# EasyEDA Pro project ProDocument_AD9744_2025-01-04.epro

# Schematic Schematic4
Create Date: 2023-10-30; Page Name: P1; Project Name: STI_Project; Schematic Name: Schematic4; Update Date: 2023-11-23; Company: 嘉立创EDA; Page Size: A4; Version: V1.0
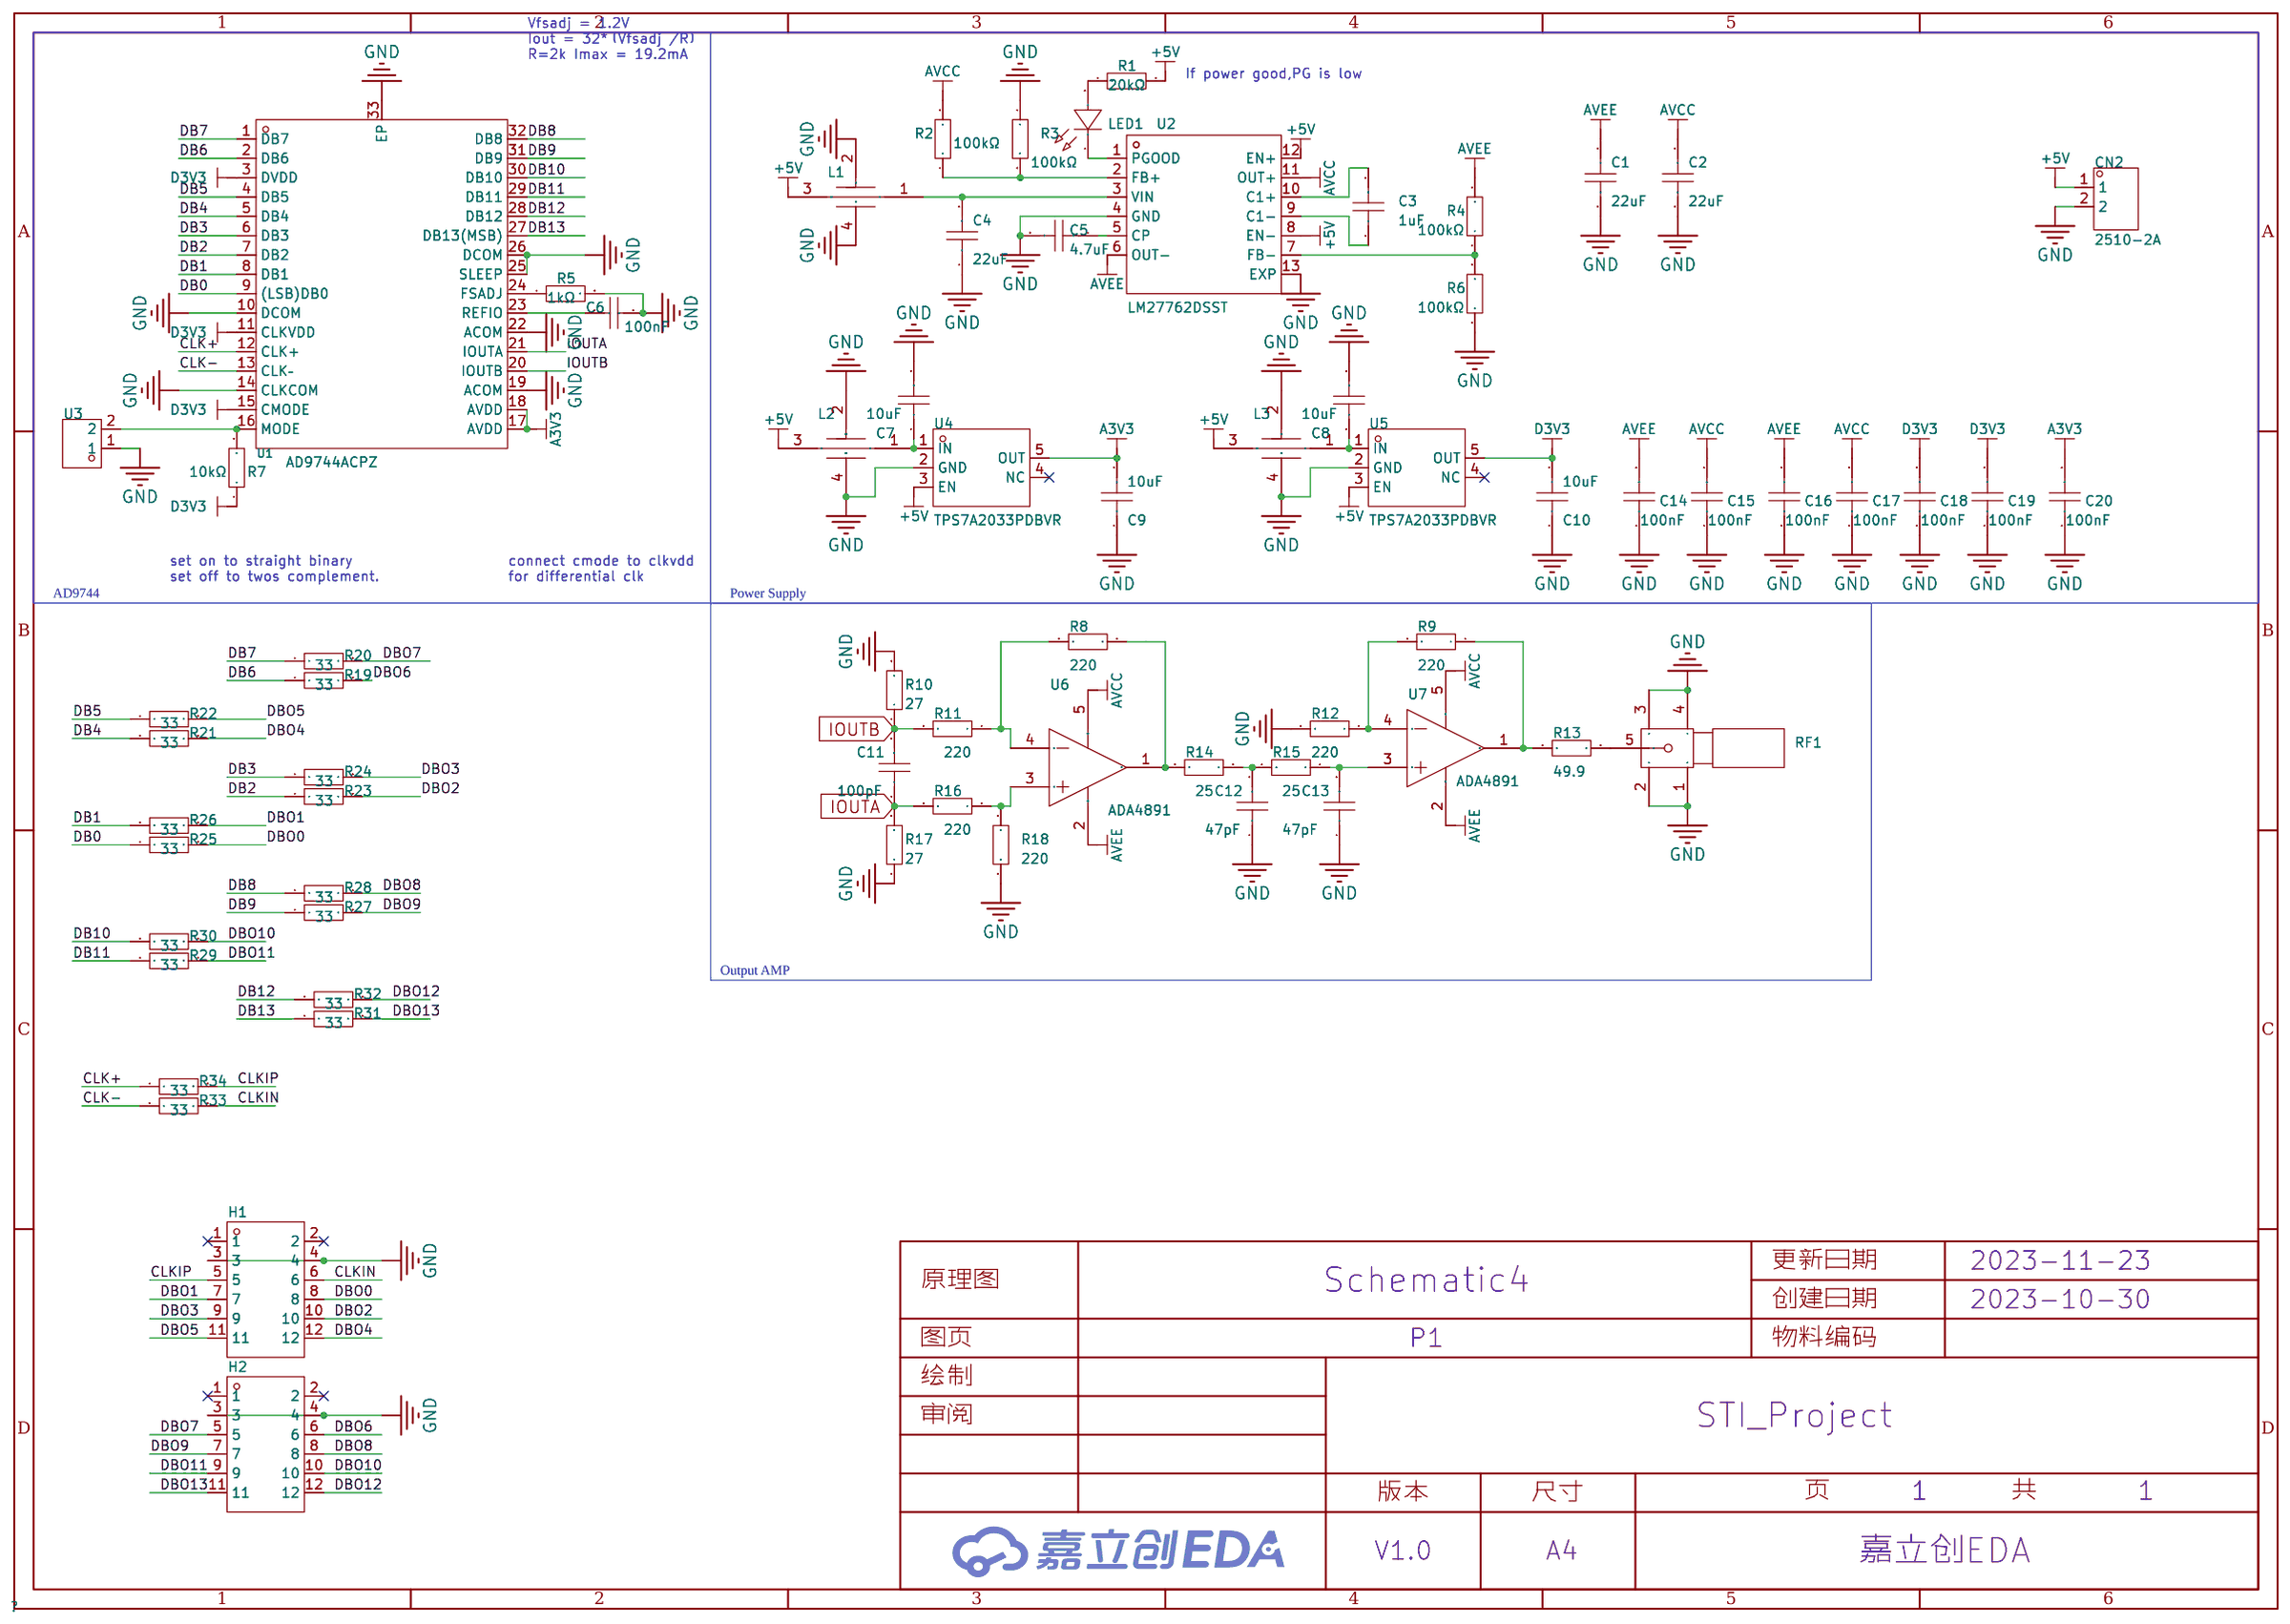
[diagram p0: schematic sheet]

## Parts
C1  22uF  [C0805]
C2  22uF  [C0805]
C3  1uF  [C0603]
C4  22uF  [C0805]
C5  4.7uF  [C0603]
C6  100nF  [C0402]
C7  10uF  [C0603]
C8  10uF  [C0603]
C9  10uF  [C0603]
C10  10uF  [C0603]
C11  100pF  [C0402]
C12  47pF  [C0402]
C13  47pF  [C0402]
C14  100nF  [C0402]
C15  100nF  [C0402]
C16  100nF  [C0402]
C17  100nF  [C0402]
C18  100nF  [C0402]
C19  100nF  [C0402]
C20  100nF  [C0402]
CN2  2510-2A  [CONN-TH_KF2510-2A]
H1  DZ254W-22-12-69  [HDR-TH_12P-P2.54-H-M-R2-C6-S2.54-W12.5]
H2  DZ254W-22-12-69  [HDR-TH_12P-P2.54-H-M-R2-C6-S2.54-W12.5]
L1  NFM21PC104R1E3D  [CAP-SMD_4P-L2.0-W1.25]
L2  NFM21PC104R1E3D  [CAP-SMD_4P-L2.0-W1.25]
L3  NFM21PC104R1E3D  [CAP-SMD_4P-L2.0-W1.25]
LED1  VLMTG1401-GS08  [LED0603-RD_GREEN]
R1  20kΩ  [R0402]
R2  100kΩ  [R0402]
R3  100kΩ  [R0402]
R4  100kΩ  [R0402]
R5  1kΩ  [R0402]
R6  100kΩ  [R0402]
R7  10kΩ  [R0402]
R8  220  [R0402]
R9  220  [R0402]
R10  27  [R0402]
R11  220  [R0402]
R12  220  [R0402]
R13  49.9  [R0603]
R14  25  [R0402]
R15  25  [R0402]
R16  220  [R0402]
R17  27  [R0402]
R18  220  [R0402]
R19  33  [R0402]
R20  33  [R0402]
R21  33  [R0402]
R22  33  [R0402]
R23  33  [R0402]
R24  33  [R0402]
R25  33  [R0402]
R26  33  [R0402]
R27  33  [R0402]
R28  33  [R0402]
R29  33  [R0402]
R30  33  [R0402]
R31  33  [R0402]
R32  33  [R0402]
R33  33  [R0402]
R34  33  [R0402]
RF1  BWSMA-KWE-Z001  [SMA-TH_BWSMA-KWE-Z001]
U1  AD9744ACPZ  [LFCSP-32_L5.0-W5.0-P0.50-TL-EP3.1]
U2  LM27762DSST  [WSON-12_L2.0-W3.0-P0.50-BL-EP]
U3  SIP2-2.54mm单排针  [HDR-TH_2P-P2.54-V-M-1]
U4  TPS7A2033PDBVR  [SOT-23-5_L2.9-W1.6-P0.95-LS2.8-BR]
U5  TPS7A2033PDBVR  [SOT-23-5_L2.9-W1.6-P0.95-LS2.8-BR]
U6  ADA4891  [SOT-23-5_L3.0-W1.7-P0.95-LS2.8-BR]
U7  ADA4891  [SOT-23-5_L3.0-W1.7-P0.95-LS2.8-BR]

## Library data of the parts
C1 C2 C4 = CL21A226MAQNNNE_C45783: 容值:22uF;精度:±20%;额定电压:25V;材质(温度系数):X5R;; LCSC Part Name: 22uF ±20% 25V; Supplier Part: C45783; Manufacturer: SAMSUNG(三星); Manufacturer Part: CL21A226MAQNNNE; Supplier Footprint: 0805; JLCPCB Part Class: 基础库; Datasheet: https://atta.szlcsc.com/upload/public/pdf/source/20160103/1457707727161.pdf; Supplier: LCSC; Tolerance: ±20%; Voltage Rated: 25V; Temperature Coefficient: X5R
C3 C5 C7-C10 = CAP_0603: Supplier Footprint: 0603
C6 = CL05B104KO5NNNC: 容值:100nF;精度:±10%;额定电压:16V;材质(温度系数):X7R;; LCSC Part Name: 100nF ±10% 16V; Supplier Part: C1525; Manufacturer: SAMSUNG(三星); Supplier Footprint: 0402; JLCPCB Part Class: Basic Part; Datasheet: https://atta.szlcsc.com/upload/public/pdf/source/20160103/1457707674891.pdf; Supplier: LCSC; Tolerance: ±10%; Voltage Rated: 16V; Temperature Coefficient: X7R
C11-C20 = CAP_0402: Supplier Footprint: 0402
CN2 = 2510-2A: 参考系列:-;间距:2.54mm;插针结构:1x2P;排数:1;每排PIN数:2;行距:-;安装方式:-;触头材质:-;; LCSC Part Name: 间距:2.54mm 1x2P; Supplier Part: C27543; Manufacturer: BOOMELE(博穆精密); Supplier Footprint: 插件,P=2.54mm; JLCPCB Part Class: 扩展库; Supplier: LCSC; Pitch: 2.54mm; Pins Structure: 1x2P; Number of Rows: 1; Number of PINs Per Row: 2
H1 H2 = DZ254W-22-12-69: 间距:2.54mm;总PIN位数:12;排数:2;插针结构:2x6P;行距:2.54mm;安装类型:弯插;圆针/方针:方针;额定电流:3A;额定电压:-;配合针长度:6mm;塑高:2.54mm;端接针长度:-;工作温度范围:-;颜色:-;; LCSC Part Name: 2.54mm 2x6P 弯插 方针; Supplier Part: C2935938; Manufacturer: DEALON(德艺隆); Supplier Footprint: 弯插,P=2.54mm; JLCPCB Part Class: Extended Part; Datasheet: https://atta.szlcsc.com/upload/public/pdf/source/20211231/A9EB3FEFD92C329C455814A6A34A72A7.pdf; Supplier: LCSC; Pitch: 2.54mm; Number of Pins: 12; Number of Rows: 2; Pin Structure: 2x6P; Row Spacing: 2.54mm; Mounting Type: 弯插; Circluar Pins/Square Pins: 方针; Current Rating (Max): 3A; Length of Mating Pin: 6mm; Insulation Height: 2.54mm
L1-L3 = NFM21PC104R1E3D: 电容量:100nF;精度:±20%;直流电阻:30mΩ;; LCSC Part Name: 100nF(104) ±20% 25V; Supplier Part: C86150; Manufacturer: muRata(村田); Supplier Footprint: 0805; JLCPCB Part Class: 扩展库; Datasheet: https://atta.szlcsc.com/upload/public/pdf/source/20180326/C86150_E4B7366323682FA84DED9003C68CA797.pdf; Supplier: LCSC; Nominal Capacitance: 100nF; CapacitanceTolerance: ±20%; DC Rated Voltage: 25V; Rated Current: 2A; DC Resistance: 30mΩ; Operating Temperature: -55℃~+125℃
LED1 = VLMTG1401-GS08: 发光颜色:翠绿;二极管配置:-;主波长:525nm;色温:-;功率:64mW;安装方式:-;; LCSC Part Name: 翠绿; Supplier Part: C511604; Manufacturer: VISHAY(威世); Supplier Footprint: 0603; JLCPCB Part Class: Extended Part; Datasheet: https://atta.szlcsc.com/upload/public/pdf/source/20200413/C511604_272E80EA2E53340B96FA7453D68B4387.pdf; Supplier: LCSC; Emitted Color: 翠绿; Dominant Wavelength: 525nm; Forward Current: 20mA; Power Dissipation: 64mW; Operating Temperature: -40℃~+80℃
R1-R7 = 0402WGF1001TCE: 电阻类型:厚膜电阻;阻值:1kΩ;精度:±1%;功率:62.5mW;; LCSC Part Name: 1kΩ ±1% 62.5mW; Supplier Part: C11702; Manufacturer: UNI-ROYAL(厚声); Supplier Footprint: 0402; JLCPCB Part Class: Basic Part; Datasheet: https://atta.szlcsc.com/upload/public/pdf/source/20200306/C422600_1E6D84923E4A46A82E41ADD87F860B5C.pdf; Supplier: LCSC; Type: 厚膜电阻; Tolerance: ±1%; Power(Watts): 62.5mW; Temperature Coefficient: ±100ppm/℃; Overload Voltage (Max): 50V; Operating Temperature Range: -55℃~+155℃
R8-R12 R14-R34 = Res_0402: Supplier Footprint: 0402
R13 = Res_0603: Supplier Footprint: 0603
RF1 = BWSMA-KWE-Z001: 连接器类型:板端;射频系列:SMA;接口类型:内孔;端口数量:1;阻抗:50Ω;频率-最大值:12.4GHz;样式:弯头;接口直径:5.3mm;接口长度/高度:-;工作温度范围:-;; LCSC Part Name: SMA 内孔 弯头 SMA 天线座 SMA弯头正脚板端座子; Supplier Part: C496551; Manufacturer: BAT WIRELESS(蝙蝠无线); Supplier Footprint: 插件; JLCPCB Part Class: 扩展库; Datasheet: https://atta.szlcsc.com/upload/public/pdf/source/20201015/C496551_6AE7B02D24D60B4F78A8937E4C4F8093.pdf; Supplier: LCSC; Connector Type: 板端; RF Series: SMA; Interface Type: 内孔; Number of Ports: 1; Impedance: 50Ω; Frequency-Max: 12.4GHz; Style: 弯头; Interface Diameter: 5.3mm
U1 = AD9744ACPZ: 接口:并行;分辨率:14位;稳定时间:11ns;INL/DNL:±0.5LSB；±0.8LSB;电源电压:2.7V~3.6V;; Supplier Part: C653767; Manufacturer: ADI(亚德诺); Supplier Footprint: LFCSP-32; JLCPCB Part Class: 扩展库; Datasheet: https://atta.szlcsc.com/upload/public/pdf/source/20191122/C461519_0CE66F4EB669333EDB67C039F6406F90.pdf; Supplier: LCSC; Interface: 并行; Resolution: 14位; Output Type: 电流-非缓冲; Settling Time: 11ns; Integral nonlinearity: ±0.5LSB；±0.8LSB; Supply Voltage: 2.7V~3.6V; Operating Temperature: -40℃~+85℃
U2 = LM27762DSST: 功能类型:电荷泵;同步整流:否;输出通道数:2;拓扑结构:-;输入电压:2.7V~5.5V;输出电压:-5V~-1.5V；1.5V~5V;输出电流(最大值):250mA;开关频率:2.3MHz;; LCSC Part Name: 电荷泵 Vin=2.7V~5.5V Vout=1.5V~5V Vout=-5V~-1.5V 250mA; Supplier Part: C134018; Manufacturer: TI(德州仪器); Supplier Footprint: WSON-12-EP(2x3); JLCPCB Part Class: Extended Part; Datasheet: https://atta.szlcsc.com/upload/public/pdf/source/20171014/C134018_15079756010181038338.pdf; Supplier: LCSC; Function: 电荷泵; Synchronous Rectification: 否; Number of Outputs: 2; Input Voltage: 2.7V~5.5V; Output Voltage: -5V~-1.5V；1.5V~5V; Output Current (Max): 250mA; Switching Frequency: 2.3MHz
U3 = SIP2-2.54mm单排针: Supplier Part: C9900009052; Supplier Footprint: TH-2P; JLCPCB Part Class: Extended Part; Supplier: LCSC
U4 U5 = TPS7A2033PDBVR: Supplier Part: C2862740; Manufacturer: TI(德州仪器); Supplier Footprint: SOT-23-5; JLCPCB Part Class: 扩展库; Datasheet: https://atta.szlcsc.com/upload/public/pdf/source/20230221/9B73099824E408F4B24BD95C528A27ED.pdf; Supplier: LCSC
U6 U7 = ADA4891-1ARJZ-R7: 运放类型:General Purpose;放大器组数:1;增益带宽积（GBP）:240MHz(-3dB);压摆率（SR）:210 V/us;电源电压:2.7V ~ 5.5V, ±1.35V ~ 2.75V;各通道供电电流:-;; Supplier Part: C141926; Manufacturer: ADI(亚德诺)/LINEAR(凌特); Supplier Footprint: SOT-23-5; JLCPCB Part Class: 扩展库; Datasheet: https://atta.szlcsc.com/upload/public/pdf/source/20171123/C141926_15114109848711137655.pdf; Supplier: LCSC; Amplifier Type: General Purpose; Number of Circuits: 1; Gain Bandwidth Product（GBP）: 240MHz(-3dB); Slew Rate（SR）: 210 V/us; Output Type: Rail-to-Rail; Supply Voltage（Single）: 2.7V ~ 5.5V, ±1.35V ~ 2.75V; Operating Temperature: -40°C ~ 125°C

## Nets
+5V: CN2.1 L1.3(OUT) L2.3(OUT) L3.3(OUT) R1.2 U2.8(EN-) U2.12(EN+) U4.3(EN) U5.3(EN)
A3V3: C9.2 C20.2 U1.17(AVDD) U1.18(AVDD) U4.5(OUT)
AVCC: C2.2 C15.2 C17.2 R2.2 U2.11(OUT+) U6.5(+VS) U7.5(+VS)
AVEE: C1.2 C14.2 C16.2 R4.2 U2.6(OUT-) U6.2(-VS) U7.2(-VS)
D3V3: C10.2 C18.2 C19.2 R7.1 U1.3(DVDD) U1.11(CLKVDD) U1.15(CMODE) U5.5(OUT)
GND: C1.1 C2.1 C4.1 C5.2 C6.2 C7.2 C8.2 C9.1 C10.1 C12.1 C13.1 C14.1 C15.1 C16.1 C17.1 C18.1 C19.1 C20.1 CN2.2 H1.3 H1.4 H2.3 H2.4 L1.2(GND) L1.4(GND) L2.2(GND) L2.4(GND) L3.2(GND) L3.4(GND) R3.1 R5.2 R6.1 R10.2 R12.2 R17.1 R18.2 RF1.1 RF1.2 RF1.3 RF1.4 U1.10(DCOM) U1.14(CLKCOM) U1.19(ACOM) U1.22(ACOM) U1.25(SLEEP) U1.26(DCOM) U1.33(EP) U2.4(GND) U2.13(EXP) U3.1 U4.2(GND) U5.2(GND)
CLK+: R33.1 U1.12(CLK+)
CLK-: R34.1 U1.13(CLK–)
CLKIN: H1.6 R34.2
CLKIP: H1.5 R33.2
DB0: R26.1 U1.9((LSB)DB0)
DB1: R25.1 U1.8(DB1)
DB2: R24.1 U1.7(DB2)
DB3: R23.1 U1.6(DB3)
DB4: R22.1 U1.5(DB4)
DB5: R21.1 U1.4(DB5)
DB6: R20.1 U1.2(DB6)
DB7: R19.1 U1.1(DB7)
DB8: R27.1 U1.32(DB8)
DB9: R28.1 U1.31(DB9)
DB10: R29.1 U1.30(DB10)
DB11: R30.1 U1.29(DB11)
DB12: R31.1 U1.28(DB12)
DB13: R32.1 U1.27(DB13(MSB))
DBO0: H1.8 R26.2
DBO1: H1.7 R25.2
DBO2: H1.10 R24.2
DBO3: H1.9 R23.2
DBO4: H1.12 R22.2
DBO5: H1.11 R21.2
DBO6: H2.6 R20.2
DBO7: H2.5 R19.2
DBO8: H2.8 R27.2
DBO9: H2.7 R28.2
DBO10: H2.10 R29.2
DBO11: H2.9 R30.2
DBO12: H2.12 R31.2
DBO13: H2.11 R32.2
IOUTA: C11.1 R16.2 R17.2 U1.21(IOUTA)
IOUTB: C11.2 R10.1 R11.2 U1.20(IOUTB)
$1N4177: C6.1 U1.23(REFIO)
$1N4181: R5.1 U1.24(FSADJ)
$1N4228: R7.2 U1.16(MODE) U3.2
$1N4235: C5.1 U2.5(CP)
$1N4241: LED1.1(K) U2.1(PGOOD)
$1N4242: LED1.2(A) R1.1
$1N4244: R2.1 R3.2 U2.2(FB+)
$1N4247: R4.1 R6.2 U2.7(FB-)
$1N4852: C4.2 L1.1(IN) U2.3(VIN)
$1N5485: C3.2 U2.10(C1+)
$1N5494: C3.1 U2.9(C1-)
$1N6244: C7.1 L2.1(IN) U4.1(IN)
$1N6533: C8.1 L3.1(IN) U5.1(IN)
$1N8189: R16.1 R18.1 U6.3(+IN)
$1N8325: R8.2 R11.1 U6.4(-IN)
$1N8336: R8.1 R14.2 U6.1(OUT)
$1N8416: C12.2 R14.1 R15.2
$1N8471: C13.2 R15.1 U7.3(+IN)
$1N8592: R9.2 R12.1 U7.4(-IN)
$1N8599: R9.1 R13.1 U7.1(OUT)
$1N15651: R13.2 RF1.5

Not connected (* = marked no-connect by the designer): H1 1* 2*; H2 1* 2*; U4 4(NC)*; U5 4(NC)*

## Notes on the sheet
- Vfsadj = 1.2V
  Iout = 32*（Vfsadj /R）
  R=2k Imax = 19.2mA
- If power good,PG is low
- set on to straight binary
  set off to twos complement.
- connect cmode to clkvdd
  for differential clk
- AD9744
- Power Supply
- Output AMP

# Board PCB4
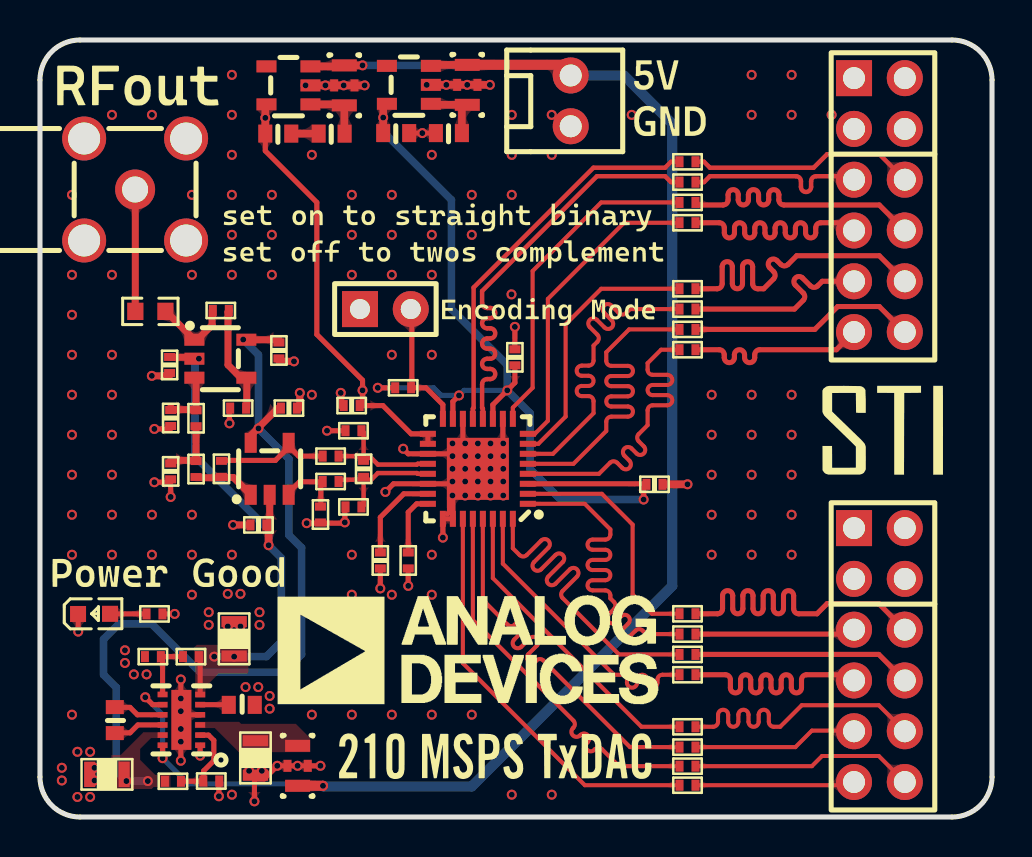
[diagram p1: board, top side]
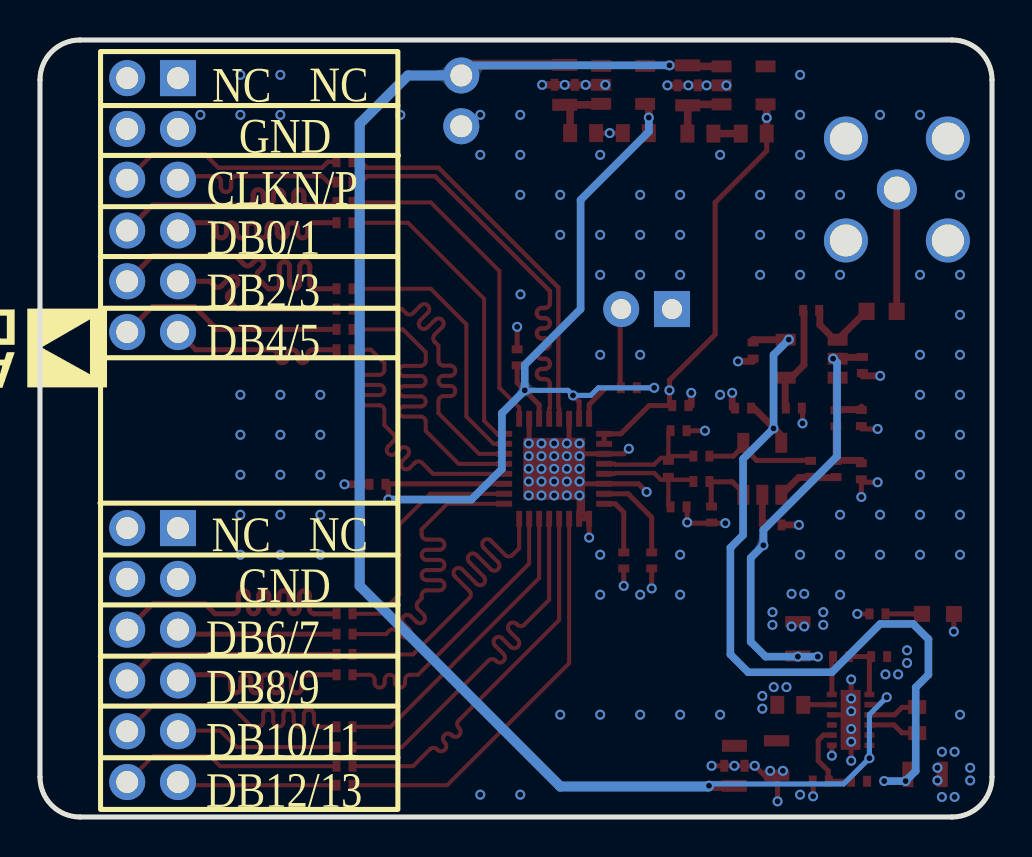
[diagram p2: board, bottom side, seen from below]

Outline 47.62 x 38.86 mm; copper layers: Top Layer, Inner1, Inner2, Bottom Layer. Coordinates in mm from the lower left corner of the outline.
Outline path: 0,36.86 0,2 arc(0.59,0.59) 2,0 45.62,0 arc(47.04,0.59) 47.62,2 47.62,36.86 arc(47.04,38.28) 45.62,38.86 2,38.86 arc(0.59,38.28) 0,36.86
Stack: Top Layer 0.035mm 外层铜厚1oz / Dielectric1 0.2104mm 7628 RC49% 8.6mil / Inner1 0.0152mm 内层铜厚 / Dielectric2 1.065mm 1.1mm H/HOZ 含铜 / Inner2 0.0152mm 内层铜厚 / Dielectric3 0.2104mm 7628 RC49% 8.6mil / Bottom Layer 0.035mm 外层铜厚1oz

## Design rules (mm)
net IOUTA: DP1
net IOUTB: DP1
net CLK-: DP2
net CLK+: DP2
net CLKIN: DP3
net CLKIP: DP3
template: 自定义配置
spacing copperThickness1oz (default): track to track 0.102, other pairs 0.152 to 0.3
spacing copperThickness2oz: track to track 0.203, other pairs 0.152 to 0.3
track width copperThickness1oz (default): min 0.127, default 0.254, max 2.54
track width copperThickness2oz: min 0.203, default 0.254, max 2.54
differential pair differentialPair (default): width min 0.127, default 0.221, max 2.54; gap min 0.203, default 0.203
via viaSize (default): diameter min 0.399, default 0.5, max 10; hole min 0.3, default 0.3, max 6.299

## Placement (name value [footprint] x y rotation side)
C1  22uF  [C0805]  9.71 8.91 270 top
C2  22uF  [C0805]  3.35 2.13 0 top
C3  1uF  [C0603]  3.74 4.85 270 top
C4  22uF  [C0805]  10.78 2.95 90 top
C5  4.7uF  [C0603]  10.09 5.61 0 top
C6  100nF  [C0402]  17.03 12.83 270 top
C7  10uF  [C0603]  14.59 34.18 180 top
C8  10uF  [C0603]  20.46 34.21 180 top
C9  10uF  [C0603]  11.92 34.18 180 top
C10  10uF  [C0603]  17.82 34.21 180 top
C11  100pF  [C0402]  16.19 17.41 90 top
C12  47pF  [C0402]  6.54 17.29 90 top
C13  47pF  [C0402]  6.54 19.95 90 top
C14  100nF  [C0402]  6.48 22.61 90 top
C15  100nF  [C0402]  11.95 23.33 90 top
C16  100nF  [C0402]  10.93 14.61 0 top
C17  100nF  [C0402]  12.45 20.45 180 top
C18  100nF  [C0402]  23.76 22.99 270 top
C19  100nF  [C0402]  30.74 16.64 180 top
C20  100nF  [C0402]  15.59 20.58 0 top
CN2  2510-2A  [CONN-TH_KF2510-2A]  26.55 35.82 90 top
H1  DZ254W-22-12-69  [HDR-TH_12P-P2.54-H-M-R2-C6-S2.54-W12.5]  41.99 30.6 90 top
H2  DZ254W-22-12-69  [HDR-TH_12P-P2.54-H-M-R2-C6-S2.54-W12.5]  41.99 8.1 90 top
L1  NFM21PC104R1E3D  [CAP-SMD_4P-L2.0-W1.25]  12.89 2.56 270 top
L2  NFM21PC104R1E3D  [CAP-SMD_4P-L2.0-W1.25]  15.22 36.59 90 top
L3  NFM21PC104R1E3D  [CAP-SMD_4P-L2.0-W1.25]  21.38 36.62 90 top
LED1  VLMTG1401-GS08  [LED0603-RD_GREEN]  2.7 10.16 0 top
R1  20kΩ  [R0402]  5.73 10.16 0 top
R2  100kΩ  [R0402]  6.65 1.79 180 top
R3  100kΩ  [R0402]  8.57 1.8 180 top
R4  100kΩ  [R0402]  7.55 8.02 0 top
R5  1kΩ  [R0402]  18.42 12.83 270 top
R6  100kΩ  [R0402]  5.65 8.02 0 top
R7  10kΩ  [R0402]  18.17 21.47 0 top
R8  220  [R0402]  9.08 17.41 90 top
R9  220  [R0402]  9.05 25.33 0 top
R10  27  [R0402]  15.68 19.32 180 top
R11  220  [R0402]  14.54 18.05 0 top
R12  220  [R0402]  9.91 20.45 180 top
R13  49.9  [R0603]  5.52 25.29 180 top
R14  25  [R0402]  7.81 17.4 270 top
R15  25  [R0402]  7.81 19.94 270 top
R16  220  [R0402]  14.54 16.78 0 top
R17  27  [R0402]  15.68 15.51 0 top
R18  220  [R0402]  14.03 15.13 270 top
R19  33  [R0402]  32.39 9.15 0 top
R20  33  [R0402]  32.39 10.16 0 top
R21  33  [R0402]  32.39 23.37 0 top
R22  33  [R0402]  32.39 24.39 0 top
R23  33  [R0402]  32.39 25.4 0 top
R24  33  [R0402]  32.39 26.42 0 top
R25  33  [R0402]  32.39 29.72 0 top
R26  33  [R0402]  32.39 30.74 0 top
R27  33  [R0402]  32.39 8.13 0 top
R28  33  [R0402]  32.39 7.12 0 top
R29  33  [R0402]  32.39 4.51 0 top
R30  33  [R0402]  32.39 3.5 0 top
R31  33  [R0402]  32.39 2.54 0 top
R32  33  [R0402]  32.39 1.59 0 top
R33  33  [R0402]  32.39 31.75 0 top
R34  33  [R0402]  32.39 32.77 0 top
RF1  BWSMA-KWE-Z001  [SMA-TH_BWSMA-KWE-Z001]  4.76 31.38 180 top
U1  AD9744ACPZ  [LFCSP-32_L5.0-W5.0-P0.50-TL-EP3.1]  21.9 17.41 180 top
U2  LM27762DSST  [WSON-12_L2.0-W3.0-P0.50-BL-EP]  7.07 4.86 90 top
U3  SIP2-2.54mm单排针  [HDR-TH_2P-P2.54-V-M-1]  17.28 25.4 0 top
U4  TPS7A2033PDBVR  [SOT-23-5_L2.9-W1.6-P0.95-LS2.8-BR]  12.43 36.59 0 top
U5  TPS7A2033PDBVR  [SOT-23-5_L2.9-W1.6-P0.95-LS2.8-BR]  18.45 36.62 0 top
U6  ADA4891  [SOT-23-5_L3.0-W1.7-P0.95-LS2.8-BR]  11.49 17.41 270 top
U7  ADA4891  [SOT-23-5_L3.0-W1.7-P0.95-LS2.8-BR]  9.02 22.92 180 top

## Footprints (pads in the part's own frame, mm; a bottom-side part is the same pattern mirrored in y, then rotated)
C0402
  rect 0.4x0.55 smd: 1(-0.4,0) 2(0.4,0)
C0603
  rect 0.7x0.9 smd: 1(-0.65,0) 2(0.65,0)
C0805
  rect 0.559x1.27 smd: 1(-0.86,0) 2(0.86,0)
CAP-SMD_4P-L2.0-W1.25
  rect 0.6x1.25 smd: 1(-1,0) 3(1,0)
  rect 0.6x0.4 smd: 2(0,-0.508) 4(0,0.508)
CONN-TH_KF2510-2A
  round 1.8 hole 1.1: 1(1.27,0) 2(-1.27,0)
HDR-TH_2P-P2.54-V-M-1
  rect 1.8x1.8 hole 1: 1(-1.27,0)
  round 1.8 hole 1: 2(1.27,0)
HDR-TH_12P-P2.54-H-M-R2-C6-S2.54-W12.5
  rect 1.801x1.801 hole 1.1: 1(6.35,1.27)
  round 1.801 hole 1.1: 2(6.35,-1.27) 3(3.81,1.27) 4(3.81,-1.27) 5(1.27,1.27) 6(1.27,-1.27) 7(-1.27,1.27) 8(-1.27,-1.27) 9(-3.81,1.27) 10(-3.81,-1.27) 11(-6.35,1.27) 12(-6.35,-1.27)
LED0603-RD_GREEN
  rect 0.8x0.8 smd: 1(-0.799,-0.004) 2(0.799,0.004)
LFCSP-32_L5.0-W5.0-P0.50-TL-EP3.1
  rect 0.8x0.3 smd: 1(-2.5,1.75) 2(-2.5,1.25) 3(-2.5,0.75) 4(-2.5,0.25) 5(-2.5,-0.25) 6(-2.5,-0.75) 7(-2.5,-1.25) 8(-2.5,-1.75) 17(2.5,-1.75) 18(2.5,-1.25) 19(2.5,-0.75) 20(2.5,-0.25) 21(2.5,0.25) 22(2.5,0.75) 23(2.5,1.25) 24(2.5,1.75)
  rect 0.299x0.8 smd: 9(-1.75,-2.5) 10(-1.25,-2.5) 11(-0.75,-2.5) 12(-0.25,-2.5) 13(0.25,-2.5) 14(0.75,-2.5) 15(1.25,-2.5) 16(1.75,-2.5) 25(1.75,2.5) 26(1.25,2.5) 27(0.75,2.5) 28(0.25,2.5) 29(-0.25,2.5) 30(-0.75,2.5) 31(-1.25,2.5) 32(-1.75,2.5)
  rect 3.1x3.1 smd: 33(0,0)
R0402
  rect 0.4x0.55 smd: 1(-0.4,0) 2(0.4,0)
R0603
  rect 0.806x0.864 smd: 1(-0.753,0) 2(0.753,0)
SMA-TH_BWSMA-KWE-Z001
  round 2.2 hole 1.6: 1(-2.55,-2.55) 2(-2.55,2.55) 3(2.55,2.55) 4(2.55,-2.55)
  round 2 hole 1.3: 5(0,0)
SOT-23-5_L2.9-W1.6-P0.95-LS2.8-BR
  rect 1x0.6 smd: 1(1.1,-0.95) 2(1.1,0) 3(1.1,0.95) 4(-1.1,0.95) 5(-1.1,-0.95)
SOT-23-5_L3.0-W1.7-P0.95-LS2.8-BR
  rect 1x0.6 smd: 1(1.3,-0.95) 2(1.3,0) 3(1.3,0.95) 4(-1.3,0.95) 5(-1.3,-0.95)
WSON-12_L2.0-W3.0-P0.50-BL-EP
  rect 0.28x0.5 smd: 1(-1.27,-0.94) 2(-0.762,-0.94) 3(-0.254,-0.94) 4(0.254,-0.94) 5(0.762,-0.94) 6(1.27,-0.94) 7(1.27,0.94) 8(0.762,0.94) 9(0.254,0.94) 10(-0.254,0.94) 11(-0.762,0.94) 12(-1.27,0.94)
  rect 3x1.001 smd: 13(0,0)

## Nets
As in the schematic.

Pads without a net: H1 1 2; H2 1 2; U4 4; U5 4

## Via types
v1: diameter 0.5, hole 0.3, Top Layer to Bottom Layer, 203 vias

## Routing (per net, layer and track width the routed paths; a pad name or vN(x,y) marks a point on that pad's centre or on a via; arc(x,y) is an arc through that point)
+5V: length 95.3
  Top Layer w0.254: 6.16,10.16 v1(6.74,10.16) ; U2.12 v1(6.13,2.94) ; U2.8 5.64,5.62 v1(5.27,5.99)
  Top Layer w0.381: v1(16.14,37.59) L2.3 15.17,37.54 U4.3 ; L3.3 19.6,37.62 19.55,37.57
  Top Layer w0.508: 26.6,37.15 26.13,37.62 21.49,37.62 ; L1.3 v1(14.16,1.56)
  Inner1 w0.254: v1(5.27,5.99) 4.43,5.99 3.18,7.24 3.18,8.89 4.45,10.16 v1(6.74,10.16)
  Bottom Layer w0.254: v1(14.16,1.56) 14.06,1.65 7.42,1.65 v1(6.13,2.94) 6.13,5.12 v1(5.27,5.99)
  Bottom Layer w0.381: 16.14,37.6 v1(16.14,37.59) 26.81,37.59
  Bottom Layer w0.508: 26.35,37.14 26.4,37.09 29.22,37.09 31.63,34.67 31.63,11.56 21.6,1.53 14.19,1.53 v1(14.16,1.56)
A3V3: length 21.5
  Top Layer w0.254: 19.4,18.67 U1.17 18.56,19.16 17.15,20.58 16.14,20.58 v1(16.14,21.34) 16.14,21.85 13.85,24.13 13.85,30.74 11.27,33.32 C9.2
  Top Layer w0.381: U4.5 11.27,35.58 v1(11.27,34.97) C9.2
AVCC: length 41.4
  Top Layer w0.345: U6.5 10.54,19.08 11.91,20.45 ; 11.95,23.88 11.94,23.87 U7.5
  Top Layer w0.381: v1(10.93,19.43) 10.97,19.47 10.97,19.51 ; U7.5 10.31,23.88 v1(10.17,23.88)
  Bottom Layer w0.381: v1(5.39,1.8) v1(4.32,1.8) 3.82,2.31 3.82,6.48 3.18,7.12 3.18,8.89 3.94,9.66 5.59,9.66 8.01,7.24 12.2,7.24 13.09,8.13 13.09,13.47 12.45,14.1 12.45,17.91 v1(10.93,19.43) 10.93,23.12 v1(10.17,23.88)
AVEE: length 25.6
  Top Layer w0.254: U2.6 8.01,8 7.99,8.02
  Top Layer w0.345: U6.2 11.49,14.62 11.47,14.61 ; 6.47,23.02 6.5,22.99 7.72,22.99
  Top Layer w0.381: v1(7.95,22.92) 7.95,22.92 U7.2 ; 11.47,14.61 11.44,14.57 v1(11.44,13.59)
  Bottom Layer w0.381: v1(8.71,8.02) v1(9.71,8.02) 11.33,8.02 12.07,8.77 12.07,12.96 v1(11.44,13.59) 11.44,14.35 7.75,18.04 7.75,22.73 v1(7.95,22.92)
D3V3: length 47.2
  Top Layer w0.254: 24.4,16.67 30.17,16.67 30.2,16.64 v1(30.2,15.88) ; 23.76,22.45 23.76,21.72 v1(23.38,21.34) 22.65,20.62 U1.11 ; v1(20.96,21.09) 20.65,20.78 U1.15 ; 17.74,21.47 v1(16.9,21.47)
  Top Layer w0.381: U5.5 17.17,35.48 v1(17.17,34.98) 17.17,33.95
  Bottom Layer w0.254: v1(23.38,21.34) 21.22,21.34 v1(20.96,21.09) 20.07,21.09 19.69,21.47 v1(16.9,21.47)
  Bottom Layer w0.381: v1(30.2,15.88) 26.04,15.88 24.52,17.4 24.52,20.2 v1(23.38,21.34) 23.38,22.61 20.58,25.4 20.58,30.86 17.17,34.28 v1(17.17,34.98)
GND: length 51.9
  Top Layer w0.254: 17.03,12.29 v1(17.03,11.43) ; 15.25,15.51 v1(15.25,14.74) 15.21,14.7 v1(13.34,14.7) ; 21.16,16.67 v1(21.9,17.41) ; 21.16,16.67 20.65,16.16 U1.26 U1.25 v1(20.15,13.97) ; 21.16,16.67 17.68,16.67 v1(17.28,16.26) ; v1(21.9,17.41) v1(22.54,18.05) 23.15,18.66 U1.10 ; v1(21.9,17.41) 21.15,18.16 ; U2.13 7.33,5.11 U2.4 ; 10.73,1.9 v1(10.73,0.78) ; 10.73,1.9 11.21,1.9 v1(11.87,2.56) L1.2 v1(12.89,2.56) L1.4 v1(14.03,2.56) ; 10.73,1.9 10.78,1.95 ; v1(8.95,1.04) 8.95,1.75 9,1.8 ; 21.15,18.16 U1.19 18.42,18.16 v1(18.17,18.42) ; 21.15,18.16 U1.14 ; 15.25,19.32 v1(14.36,19.32) ; v1(6.54,16.01) 6.54,16.74 v1(5.72,16.74) ; 6.54,19.41 v1(5.72,19.41) ; 18.42,12.4 v1(18.42,11.56) ; 18.47,33.95 18.72,34.21 v1(19.12,34.21) 19.55,34.21 19.81,33.95 ; 9.48,20.38 v1(9.48,19.69) ; 20.48,16.01 20.48,15.26 20.38,15.15 ; 23.76,23.54 v1(23.76,24.51) ; v1(7.05,2.81) v1(7.05,3.77) v1(7.05,4.4) v1(7.05,5.29) v1(7.05,5.93) v1(7.05,6.88)
  Top Layer w0.345: 6.48,22.06 v1(5.59,22.06) ; 13,20.45 v1(13,21.21) ; 11.95,22.79 v1(12.71,22.79) ; 10.38,14.61 v1(9.66,14.61) ; 15.05,20.58 v1(15.05,21.21)
  Top Layer w0.381: v1(16.24,36.59) L2.2 v1(15.19,36.59) L2.4 v1(14.28,36.59) U4.2 ; C9.1 C7.2 ; L3.2 v1(21.37,36.62) L3.4 v1(20.33,36.62) U5.2 ; 21.93,36.62 v1(22.51,36.62) ; 31.29,16.64 v1(32.39,16.64)
  Bottom Layer w0.254: v1(5.72,19.41) 5.72,19.43 ; v1(5.72,16.74) 5.72,16.77 ; v1(13.34,14.7) 13.34,14.61
  Bottom Layer w0.345: v1(5.59,22.06) 5.59,22.1
  vias: v1(1.09,2.46) v1(1.09,1.83) v1(1.6,31.12) v1(1.6,27.12) v1(1.6,25.12) v1(1.6,23.12) v1(1.6,21.12) v1(1.6,19.12) v1(1.6,17.12) v1(1.6,15.12) v1(1.6,13.12) v1(1.6,5.12) v1(1.87,3.26) v1(1.87,1) v1(2.51,3.26) v1(2.51,1) v1(2.73,2.46) v1(2.73,1.83) v1(3.6,35.12) v1(3.6,27.12) v1(3.6,23.12) v1(3.6,21.12) v1(3.6,19.12) v1(3.6,17.12) v1(3.6,15.12) v1(3.6,13.12) v1(4.25,8.34) v1(4.25,7.7) v1(4.7,7.13) v1(5.33,7.13) v1(5.6,35.12) v1(5.6,15.12) v1(5.6,13.12) v1(7.6,31.12) v1(7.6,27.12) v1(7.6,15.12) v1(7.6,13.12) v1(7.6,11.12) v1(8.44,10.24) v1(8.44,9.61) v1(9.39,11.16) v1(9.39,9.53) v1(9.6,37.12) v1(9.6,35.12) v1(9.6,33.12) v1(9.6,31.12) v1(9.6,29.12) v1(9.6,27.12) v1(9.6,13.12) v1(9.6,1.12) v1(10.03,11.16) v1(10.03,9.53) v1(10.28,6.5) v1(10.46,2.31) v1(10.98,10.24) v1(10.98,9.61) v1(10.92,6.5) v1(11.1,2.31) v1(11.49,6.05) v1(11.49,5.42) v1(11.6,31.12) v1(11.6,29.12) v1(11.6,27.12) v1(13.29,36.59) v1(13.6,33.12) v1(13.6,21.12) v1(13.6,5.12) v1(15.6,31.12) v1(15.6,29.12) v1(15.6,27.12) v1(15.6,13.12) v1(15.6,11.12) v1(15.6,5.12) v1(17.6,31.12) v1(17.6,29.12) v1(17.6,27.12) v1(17.6,23.12) v1(17.6,11.12) v1(17.6,5.12) v1(19.34,36.62) v1(19.6,33.12) v1(19.6,29.12) v1(19.6,27.12) v1(19.6,23.12) v1(19.6,13.12) v1(19.6,11.12) v1(19.6,5.12) v1(20.63,18.68) v1(20.63,18.05) v1(20.63,17.41) v1(20.63,16.78) v1(20.63,16.08) v1(21.27,18.68) v1(21.27,18.05) v1(21.27,17.41) v1(21.27,16.78) v1(21.27,16.08) v1(21.6,31.12) v1(21.6,29.12) v1(21.6,5.12) v1(21.9,18.68) v1(21.9,18.05) v1(21.9,16.78) v1(21.9,16.08) v1(22.54,18.68) v1(22.54,17.41) v1(22.54,16.78) v1(22.54,16.08) v1(23.17,18.68) v1(23.17,18.05) v1(23.17,17.41) v1(23.17,16.78) v1(23.17,16.08) v1(23.6,35.12) v1(23.6,33.12) v1(23.6,31.12) v1(23.59,26.14) v1(23.6,1.12) v1(25.6,35.12) v1(25.6,33.12) v1(25.6,1.12) v1(29.6,35.12) v1(33.6,21.12) v1(33.6,19.12) v1(33.6,17.12) v1(33.6,15.12) v1(33.6,13.12) v1(35.6,37.12) v1(35.6,35.12) v1(35.6,21.12) v1(35.6,19.12) v1(35.6,17.12) v1(35.6,15.12) v1(35.6,13.12) v1(37.6,37.12) v1(37.6,35.12) v1(37.6,21.12) v1(37.6,19.12) v1(37.6,17.12) v1(37.6,15.12) v1(37.6,13.12) v1(39.6,35.12)
CLK+: length 22.3
  Top Layer w0.221: U1.12 22.15,20.43 22.12,20.46 22.12,21.65 arc(22.19,21.83) 22.37,21.9 22.52,21.9 arc(22.77,22.16) 22.52,22.41 22.37,22.41 arc(22.12,22.66) 22.37,22.92 22.52,22.92 arc(22.77,23.17) 22.52,23.43 22.37,23.43 arc(22.12,23.68) 22.37,23.93 22.52,23.93 arc(22.77,24.19) 22.52,24.44 22.37,24.44 arc(22.12,24.7) 22.37,24.95 22.52,24.95 arc(22.77,25.2) 22.52,25.46 22.37,25.46 arc(22.19,25.53) 22.12,25.71 22.12,26.3 27.86,32.05 31.27,32.05 31.57,31.75 31.96,31.75
CLK-: length 19.5
  Top Layer w0.221: 31.96,32.77 31.57,32.77 31.27,32.47 27.69,32.47 21.69,26.48 21.69,20.46 21.65,20.43 U1.13
CLKIN: length 11.4
  Top Layer w0.221: 32.83,32.77 33.22,32.77 33.51,32.47 38.7,32.47 39.38,33.15 41.99,33.15 H1.6
CLKIP: length 9.2
  Top Layer w0.221: H1.5 40.55,32.05 38.83,32.05 arc(38.65,31.98) 38.57,31.8 38.57,31.51 arc(38.32,31.26) 38.07,31.51 38.07,31.8 arc(37.99,31.98) 37.81,32.05 33.51,32.05 33.22,31.75 32.83,31.75
DB0: length 16.5
  Top Layer w0.203: U1.9 23.65,20.48 24.65,21.47 24.65,27.31 28.07,30.74 31.96,30.74
DB1: length 15.5
  Top Layer w0.203: U1.8 24.76,19.16 25.41,19.82 25.41,25.91 29.22,29.72 31.96,29.72
DB2: length 13.5
  Top Layer w0.203: 24.4,18.67 24.93,18.67 26.3,20.03 26.3,24.64 28.07,26.42 31.96,26.42
DB3: length 18.3
  Top Layer w0.203: U1.6 25.66,18.16 27.69,20.2 27.69,20.8 arc(27.62,20.98) 27.44,21.05 27.1,21.05 arc(26.85,21.31) 27.1,21.56 27.44,21.56 arc(27.69,21.81) 27.44,22.07 27.1,22.07 arc(26.85,22.32) 27.1,22.58 27.44,22.58 arc(27.62,22.65) 27.69,22.83 27.69,23.58 27.88,23.77 arc(27.95,23.95) 27.88,24.13 27.5,24.51 arc(27.5,24.87) 27.86,24.87 28.24,24.48 arc(28.6,24.48) 28.6,24.84 28.22,25.23 arc(28.22,25.58) 28.58,25.58 28.96,25.2 arc(29.14,25.13) 29.32,25.2 29.52,25.4 31.96,25.4
DB4: length 19.3
  Top Layer w0.203: 24.4,17.67 26.69,17.67 28.33,19.31 28.33,19.77 arc(28.4,19.95) 28.58,20.02 29.41,20.02 arc(29.66,20.28) 29.41,20.53 28.58,20.53 arc(28.33,20.79) 28.58,21.04 29.41,21.04 arc(29.66,21.29) 29.41,21.55 28.58,21.55 arc(28.33,21.8) 28.58,22.06 29.41,22.06 arc(29.66,22.31) 29.41,22.56 28.58,22.56 arc(28.4,22.64) 28.33,22.82 28.33,23.24 29.47,24.39 31.96,24.39
DB5: length 18.6
  Top Layer w0.203: 31.96,23.37 31.07,23.37 30.4,22.7 30.4,22.37 arc(30.47,22.19) 30.65,22.12 31.38,22.12 arc(31.63,21.86) 31.38,21.61 30.65,21.61 arc(30.4,21.35) 30.65,21.1 31.38,21.1 arc(31.63,20.85) 31.38,20.59 30.65,20.59 arc(30.47,20.52) 30.4,20.34 30.4,19.6 29.95,19.15 arc(29.88,18.97) 29.95,18.79 30.21,18.54 arc(30.21,18.18) 29.85,18.18 29.59,18.43 arc(29.23,18.43) 29.23,18.07 29.49,17.82 arc(29.49,17.46) 29.13,17.46 28.87,17.72 arc(28.69,17.79) 28.51,17.72 27.96,17.16 U1.4
DB6: length 12.1
  Top Layer w0.203: 31.96,10.16 30.61,10.16 29.65,11.13 29.65,14.62 28.11,16.16 U1.2
DB7: length 20.5
  Top Layer w0.203: 31.96,9.15 30.32,9.15 30.15,9.32 arc(29.97,9.4) 29.79,9.32 29.51,9.05 arc(29.16,9.04) 29.16,9.4 29.43,9.68 arc(29.43,10.04) 29.07,10.04 28.8,9.76 arc(28.44,9.76) 28.44,10.12 28.71,10.4 arc(28.79,10.58) 28.71,10.76 28.53,10.94 28.53,11.08 arc(28.46,11.26) 28.28,11.34 27.65,11.34 arc(27.39,11.59) 27.65,11.84 28.28,11.84 arc(28.53,12.1) 28.28,12.35 27.65,12.35 arc(27.39,12.61) 27.65,12.86 28.28,12.86 arc(28.53,13.11) 28.28,13.37 27.65,13.37 arc(27.39,13.62) 27.65,13.88 28.28,13.88 arc(28.46,13.95) 28.53,14.13 28.53,14.38 27.25,15.67 24.4,15.67
DB8: length 19.9
  Top Layer w0.203: U1.32 23.65,13.44 23.99,13.1 arc(24.17,13.03) 24.35,13.1 25.07,13.83 arc(25.43,13.83) 25.43,13.47 24.71,12.74 arc(24.71,12.39) 25.07,12.39 25.79,13.11 arc(26.15,13.11) 26.15,12.75 25.43,12.03 arc(25.43,11.67) 25.79,11.67 26.51,12.39 arc(26.87,12.39) 26.87,12.03 26.15,11.31 arc(26.07,11.13) 26.15,10.95 28.96,8.13 31.96,8.13
DB9: length 15.1
  Top Layer w0.203: 31.96,7.12 31.14,7.12 arc(30.96,7.04) 30.89,6.86 30.89,6.72 arc(30.63,6.47) 30.38,6.72 30.38,6.86 arc(30.13,7.12) 29.87,6.86 29.87,6.72 arc(29.62,6.47) 29.36,6.72 29.36,6.86 arc(29.29,7.04) 29.11,7.12 28.71,7.12 23.15,12.67 U1.31
DB10: length 15.4
  Top Layer w0.203: U1.30 22.65,11.95 30.09,4.51 31.96,4.51
DB11: length 20.3
  Top Layer w0.203: 31.96,3.5 29.52,3.5 25.19,7.83 arc(25.01,7.9) 24.83,7.83 24.79,7.79 arc(24.44,7.79) 24.44,8.15 24.86,8.58 arc(24.86,8.94) 24.5,8.94 24.08,8.51 arc(23.72,8.51) 23.72,8.87 24.14,9.3 arc(24.14,9.65) 23.78,9.65 23.75,9.62 arc(23.57,9.55) 23.39,9.62 22.15,10.86 U1.29
DB12: length 19.7
  Top Layer w0.203: U1.28 21.65,9.85 26.68,4.82 arc(26.76,4.64) 26.68,4.47 26.66,4.44 arc(26.66,4.08) 27.02,4.08 27.04,4.11 arc(27.4,4.11) 27.4,3.75 27.37,3.72 arc(27.37,3.36) 27.73,3.36 27.76,3.39 arc(27.94,3.46) 28.12,3.39 28.96,2.54 31.96,2.54
DB13: length 20.6
  Top Layer w0.203: U1.27 21.15,7.69 27.26,1.59 31.96,1.59
DBO0: length 14.3
  Top Layer w0.254: 32.83,30.74 32.95,30.61 34.17,30.61 arc(34.35,30.68) 34.42,30.86 34.42,31.12 arc(34.68,31.38) 34.93,31.12 34.93,30.86 arc(35.18,30.61) 35.44,30.86 35.44,31.12 arc(35.69,31.38) 35.95,31.12 35.95,30.86 arc(36.2,30.61) 36.45,30.86 36.45,31.12 arc(36.71,31.38) 36.96,31.12 36.96,30.86 arc(37.04,30.68) 37.22,30.61 41.99,30.61 H1.8
DBO1: length 13.5
  Top Layer w0.254: 32.83,29.72 33.98,29.72 arc(34.16,29.65) 34.23,29.47 34.23,29.22 arc(34.49,28.96) 34.74,29.22 34.74,29.47 arc(35,29.72) 35.25,29.47 35.25,29.22 arc(35.5,28.96) 35.76,29.22 35.76,29.47 arc(36.01,29.72) 36.27,29.47 36.27,29.22 arc(36.52,28.96) 36.77,29.22 36.77,29.47 arc(37.03,29.72) 37.28,29.47 37.28,29.22 arc(37.54,28.96) 37.79,29.22 37.79,29.47 arc(38.04,29.72) 38.3,29.47 38.3,29.22 arc(38.55,28.96) 38.81,29.22 38.81,29.47 arc(38.88,29.65) 39.06,29.72 40.33,29.72 H1.7
DBO2: length 17.3
  Top Layer w0.254: 32.83,26.42 33.87,26.42 arc(34.05,26.49) 34.13,26.67 34.13,27.52 arc(34.38,27.78) 34.63,27.52 34.63,26.67 arc(34.89,26.42) 35.14,26.67 35.14,27.52 arc(35.4,27.78) 35.65,27.52 35.65,26.67 arc(35.72,26.49) 35.9,26.42 36.2,26.42 36.7,26.92 arc(36.77,27.1) 36.7,27.28 36.5,27.47 arc(36.5,27.83) 36.86,27.83 37.06,27.64 arc(37.24,27.56) 37.42,27.64 37.85,28.07 41.99,28.07 H1.10
DBO3: length 10.2
  Top Layer w0.254: 32.83,25.4 37.74,25.4 38.18,25.85 arc(38.26,26.03) 38.18,26.2 37.78,26.6 arc(37.78,26.96) 38.14,26.96 38.54,26.56 arc(38.72,26.49) 38.9,26.56 39.13,26.79 H1.9
DBO4: length 11.4
  Top Layer w0.254: 32.83,24.39 38.76,24.39 39.9,25.53 41.99,25.53 H1.12
DBO5: length 10
  Top Layer w0.254: 32.83,23.37 33.98,23.37 arc(34.16,23.3) 34.23,23.12 34.23,22.98 arc(34.48,22.72) 34.74,22.98 34.74,23.12 arc(34.99,23.37) 35.25,23.12 35.25,22.98 arc(35.5,22.72) 35.75,22.98 35.75,23.12 arc(35.83,23.3) 36.01,23.37 39.84,23.37 H1.11
DBO6: length 18.7
  Top Layer w0.254: H2.6 41.96,10.67 39.38,10.67 38.87,10.16 37.96,10.16 arc(37.78,10.24) 37.7,10.42 37.7,11.07 arc(37.45,11.32) 37.19,11.07 37.19,10.42 arc(36.94,10.16) 36.69,10.42 36.69,11.07 arc(36.43,11.32) 36.18,11.07 36.18,10.42 arc(35.92,10.16) 35.67,10.42 35.67,11.07 arc(35.41,11.32) 35.16,11.07 35.16,10.42 arc(34.91,10.16) 34.65,10.42 34.65,11.07 arc(34.4,11.32) 34.15,11.07 34.15,10.42 arc(34.07,10.24) 33.89,10.16 32.83,10.16
DBO7: length 8
  Top Layer w0.254: 32.83,9.15 40.5,9.15 H2.5
DBO8: length 11
  Top Layer w0.254: 32.83,8.13 41.96,8.13 H2.8
DBO9: length 13.5
  Top Layer w0.254: 32.83,7.12 34.28,7.12 arc(34.46,7.04) 34.54,6.86 34.54,6.46 arc(34.79,6.21) 35.05,6.46 35.05,6.86 arc(35.3,7.12) 35.55,6.86 35.55,6.46 arc(35.81,6.21) 36.06,6.46 36.06,6.86 arc(36.32,7.12) 36.57,6.86 36.57,6.46 arc(36.82,6.21) 37.08,6.46 37.08,6.86 arc(37.33,7.12) 37.59,6.86 37.59,6.46 arc(37.84,6.21) 38.09,6.46 38.09,6.86 arc(38.17,7.04) 38.35,7.12 40.44,7.12 H2.7
DBO10: length 15.2
  Top Layer w0.203: H2.10 41.96,5.59 38.11,5.59 37.03,4.51 36.71,4.51 arc(36.53,4.59) 36.46,4.77 36.46,5.11 arc(36.21,5.36) 35.95,5.11 35.95,4.77 arc(35.7,4.51) 35.44,4.77 35.44,5.11 arc(35.19,5.36) 34.94,5.11 34.94,4.77 arc(34.68,4.51) 34.43,4.77 34.43,5.11 arc(34.17,5.36) 33.92,5.11 33.92,4.77 arc(33.85,4.59) 33.67,4.51 32.82,4.51
DBO11: length 8.3
  Top Layer w0.203: 32.82,3.5 37.79,3.5 38.62,4.32 40.69,4.32 H2.9
DBO12: length 11.2
  Top Layer w0.203: H2.12 41.96,3.05 39.12,3.05 38.62,2.54 32.83,2.54
DBO13: length 8
  Top Layer w0.203: H2.11 40.56,1.59 32.82,1.59
IOUTA: length 6
  Top Layer w0.221: 16.19,16.87 16.57,16.87 16.9,17.2 18.86,17.2 18.89,17.16 U1.21 ; 16.19,16.87 16.19,15.59 16.11,15.51 ; 16.19,16.87 15.06,16.87 14.97,16.78
IOUTB: length 6
  Top Layer w0.221: 16.11,19.32 16.19,19.24 16.19,17.96 ; 16.19,17.96 16.57,17.96 16.9,17.63 18.86,17.63 18.89,17.67 19.4,17.67 ; 16.19,17.96 16.1,18.05 14.97,18.05
$1N4177: length 4.5
  Top Layer w0.254: U1.23 18.2,16.16 17.03,14.99 17.03,13.38
$1N4181: length 3.1
  Top Layer w0.254: 19.4,15.67 18.84,15.67 18.42,15.24 18.42,13.26
$1N4228: length 6.6
  Top Layer w0.254: U3.2 18.6,25.35 18.6,21.47 19.31,21.47 20.15,20.62 U1.16
$1N4235: length 1.4
  Top Layer w0.254: C5.1 9.43,5.62 U2.5
$1N4241: length 13.1
  Top Layer w0.254: LED1.1 1.91,10.15 v1(1.91,9.27) ; U2.1 v1(8.01,3.07)
  Inner1 w0.254: v1(1.91,9.27) 1.91,6.23 6.23,1.91 7.25,1.91 8.01,2.68 v1(8.01,3.07)
  Bottom Layer w0.254: v1(8.01,3.07) 7.93,3.07
$1N4242: length 1.8
  Top Layer w0.254: LED1.2 5.29,10.16 5.3,10.16
$1N4244: length 4.2
  Top Layer w0.254: 8.14,1.8 8.12,1.79 7.09,1.79 ; U2.2 8.43,4.1 8.7,3.83 8.7,2.81 8.19,2.31 8.19,1.98 8.01,1.8
$1N4247: length 2.9
  Top Layer w0.254: U2.7 6.13,7.97 ; 6.13,7.97 6.08,8.02 ; 6.13,7.97 6.19,8.02 7.12,8.02
$1N5485: length 2.6
  Top Layer w0.254: U2.10 4.9,4.6 4.5,4.21 3.76,4.21 C3.2
$1N5494: length 2.5
  Top Layer w0.254: C3.1 3.76,5.48 4.5,5.48 4.88,5.11 U2.9
$1N6244: length 3.1
  Top Layer w0.381: U4.1 15.17,35.64 L2.1 15.22,34.19 C7.1
$1N6533: length 3.5
  Top Layer w0.381: U5.1 19.6,35.62 21.11,35.62 ; 21.11,35.62 21.11,33.95 ; 21.11,35.62 L3.1
$1N8189: length 3
  Top Layer w0.254: 14.01,16.75 14.05,16.72 14.05,15.56 ; 12.46,16.23 12.99,16.77 14.07,16.77
$1N8325: length 5.6
  Top Layer w0.254: 14.11,18.05 12.94,18.05 12.44,18.55 U6.4 ; 9.07,17.84 11.78,17.84 12.37,18.43
$1N8336: length 3.1
  Top Layer w0.345: 7.81,16.97 9.07,16.97 9.08,16.98 9.67,16.98 U6.1
$1N8416: length 2.9
  Top Layer w0.345: 7.81,19.51 7.81,17.84 6.54,17.84 6.54,17.83
$1N8471: length 3
  Top Layer w0.345: 6.54,20.5 6.66,20.38 7.81,20.38 7.81,21.89 U7.3
$1N8592: length 5.5
  Top Layer w0.345: 10.35,20.45 10.35,21.95 U7.4 10.04,21.97 9.41,22.61 9.41,25.26 9.48,25.33
$1N8599: length 4
  Top Layer w0.345: 8.61,25.33 8.61,24.61 7.87,23.87 U7.1 6.31,25.29 R13.1
$1N15651: length 6.1
  Top Layer w0.345: R13.2 4.77,31.38 4.76,31.39

## Copper pours and planes (outline as drawn; the poured copper is in the pictures)
AVCC on Top Layer: 3.57,4.24 6.53,4.24 6.53,1.4 3.57,1.4
AVEE on Top Layer: 7.7,8.61 10.43,8.61 10.43,5.98 7.7,5.98
GND on Top Layer: -0.25,38.99 47.76,38.99 47.76,-0.12 -0.25,-0.12
GND on Bottom Layer: -0.25,38.99 47.77,38.99 47.77,-0.12 -0.25,-0.12
GND on Inner1: -0.5,39.25 47.63,39.25 47.63,-0.5 -0.5,-0.5
GND on Inner2: -0.5,39.25 47.76,39.25 47.76,-0.5 -0.5,-0.5
$1N4852 on Top Layer: 7.75,4.76 13.52,4.76 13.52,3.24 7.75,3.24

Small or netless copper shapes (teardrops, artwork), in the pictures only: 312 on Top Layer, 14 on Bottom Layer, 4 on Inner1

## Text on the board
Bottom Silkscreen Layer: NC | GND | CLKN/P | DB0/1 | DB2/3 | DB4/5 | DB6/7 | DB8/9 | DB10/11 | DB12/13
Top Silkscreen Layer: Pmode 外长19.5mm 内长15mm / 外比内长88.5mil即可 / 外1212mil内1123
